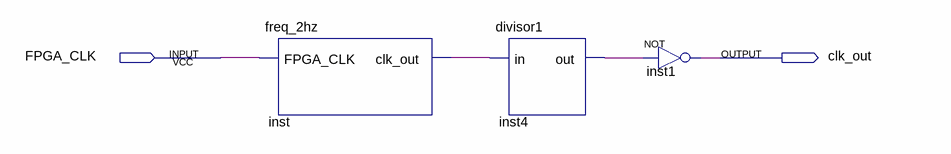
[diagram p0: schematic sheet]
// Quartus schematic freq_1hz.bdf as structural Verilog: 3 symbols, 2 pins
module freq_1hz (
  input  FPGA_CLK,
  output clk_out
);

  wire inst4_out, inst_clk_out;

  freq_2hz inst (.FPGA_CLK(FPGA_CLK), .clk_out(inst_clk_out));
  divisor1 inst4 (.in(inst_clk_out), .out(inst4_out));
  not inst1 (clk_out, inst4_out);
endmodule
